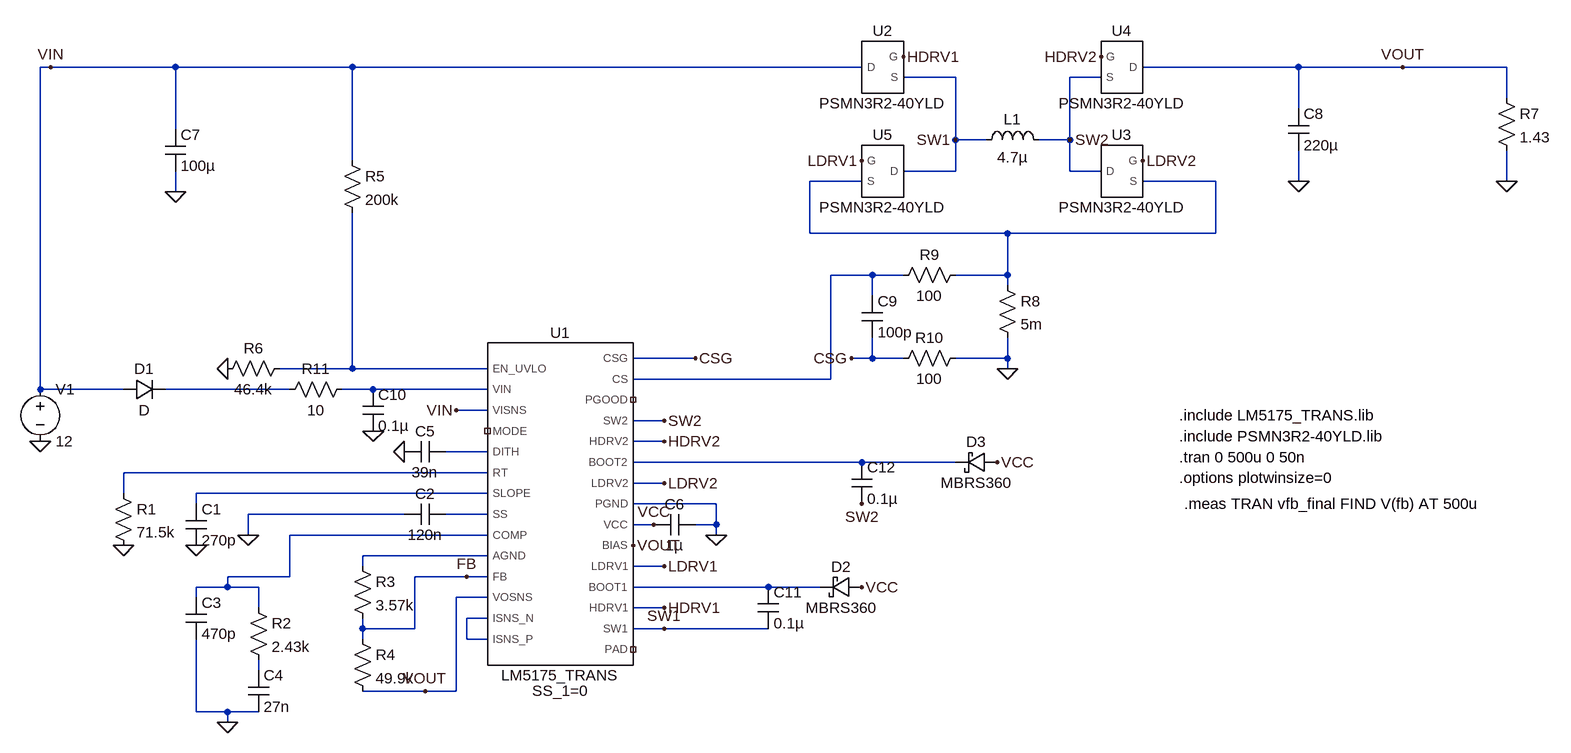
[diagram p0: schematic Buckboost.asc]
Buckboost.asc, the LTspice schematic file:
Version 4.1
SHEET 1 1516 680
WIRE -800 -656 -816 -656
WIRE -608 -656 -800 -656
WIRE -336 -656 -608 -656
WIRE 448 -656 -336 -656
WIRE 1120 -656 880 -656
WIRE 1280 -656 1120 -656
WIRE 1440 -656 1280 -656
WIRE 592 -640 512 -640
WIRE 816 -640 768 -640
WIRE 1440 -608 1440 -656
WIRE 1120 -592 1120 -656
WIRE -608 -560 -608 -656
WIRE 592 -544 592 -640
WIRE 640 -544 592 -544
WIRE 768 -544 768 -640
WIRE 768 -544 720 -544
WIRE -336 -512 -336 -656
WIRE 592 -496 592 -544
WIRE 592 -496 512 -496
WIRE 768 -496 768 -544
WIRE 816 -496 768 -496
WIRE 448 -480 368 -480
WIRE 992 -480 880 -480
WIRE 1120 -480 1120 -528
WIRE 1440 -480 1440 -528
WIRE -608 -464 -608 -496
WIRE 368 -400 368 -480
WIRE 672 -400 368 -400
WIRE 992 -400 992 -480
WIRE 992 -400 672 -400
WIRE 464 -336 400 -336
WIRE 512 -336 464 -336
WIRE 672 -336 672 -400
WIRE 672 -336 592 -336
WIRE 672 -320 672 -336
WIRE 464 -304 464 -336
WIRE 192 -208 96 -208
WIRE 464 -208 464 -240
WIRE 464 -208 432 -208
WIRE 512 -208 464 -208
WIRE 672 -208 672 -240
WIRE 672 -208 592 -208
WIRE -336 -192 -336 -432
WIRE -336 -192 -448 -192
WIRE -128 -192 -336 -192
WIRE 672 -192 672 -208
WIRE 400 -176 400 -336
WIRE 400 -176 96 -176
WIRE -816 -160 -816 -656
WIRE -688 -160 -816 -160
WIRE -432 -160 -624 -160
WIRE -304 -160 -352 -160
WIRE -128 -160 -304 -160
WIRE -128 -128 -176 -128
WIRE 144 -112 96 -112
WIRE 144 -80 96 -80
WIRE -128 -64 -192 -64
WIRE 448 -48 96 -48
WIRE 592 -48 448 -48
WIRE -128 -32 -688 -32
WIRE 144 -16 96 -16
WIRE -688 0 -688 -32
WIRE -128 0 -576 0
WIRE -576 16 -576 0
WIRE 224 16 96 16
WIRE -256 32 -496 32
WIRE -128 32 -192 32
WIRE 128 48 96 48
WIRE 224 48 224 16
WIRE 224 48 192 48
WIRE -496 64 -496 32
WIRE -128 64 -432 64
WIRE 224 64 224 48
WIRE -128 96 -320 96
WIRE -320 112 -320 96
WIRE 144 112 96 112
WIRE -432 128 -432 64
WIRE -432 128 -528 128
WIRE -160 128 -240 128
WIRE -128 128 -160 128
WIRE -528 144 -528 128
WIRE -528 144 -576 144
WIRE -480 144 -528 144
WIRE 304 144 96 144
WIRE 384 144 304 144
WIRE -576 160 -576 144
WIRE -128 160 -176 160
WIRE -480 176 -480 144
WIRE 144 176 96 176
WIRE -128 192 -160 192
WIRE -320 208 -320 192
WIRE -240 208 -240 128
WIRE -240 208 -320 208
WIRE 144 208 96 208
WIRE 304 208 144 208
WIRE -320 224 -320 208
WIRE -160 224 -160 192
WIRE -128 224 -160 224
WIRE -480 272 -480 256
WIRE -224 304 -320 304
WIRE -176 304 -176 160
WIRE -176 304 -224 304
WIRE -576 336 -576 224
WIRE -528 336 -576 336
WIRE -480 336 -528 336
WIRE -528 352 -528 336
FLAG -688 80 0
FLAG -576 80 0
FLAG -496 64 0
FLAG -528 352 0
FLAG -256 -64 0
FLAG 224 64 0
FLAG -816 -80 0
FLAG -528 -192 0
FLAG 128 48 VCC
FLAG 144 208 SW1
FLAG 592 -544 SW1
FLAG 144 -112 SW2
FLAG 768 -544 SW2
FLAG 144 112 LDRV1
FLAG 448 -512 LDRV1
FLAG 144 -16 LDRV2
FLAG 880 -512 LDRV2
FLAG 144 176 HDRV1
FLAG 512 -672 HDRV1
FLAG 816 -672 HDRV2
FLAG 144 -80 HDRV2
FLAG -608 -464 0
FLAG 1120 -480 0
FLAG 1440 -480 0
FLAG 192 -208 CSG
FLAG 432 -208 CSG
FLAG 672 -192 0
FLAG 1280 -656 VOUT
FLAG -224 304 VOUT
FLAG -304 -96 0
FLAG 448 144 VCC
FLAG 448 16 SW2
FLAG 656 -48 VCC
FLAG -800 -656 VIN
FLAG -176 -128 VIN
FLAG 96 80 VOUT
FLAG -160 128 FB
SYMBOL LM5175_TRANS -16 16 R0
SYMATTR InstName U1
SYMBOL res -704 -16 R0
SYMATTR InstName R1
SYMATTR Value 71.5k
SYMBOL cap -592 16 R0
SYMATTR InstName C1
SYMATTR Value 270p
SYMBOL cap -192 16 R90
WINDOW 0 0 32 VBottom 2
WINDOW 3 32 32 VTop 2
SYMATTR InstName C2
SYMATTR Value 120n
SYMBOL res -496 160 R0
SYMATTR InstName R2
SYMATTR Value 2.43k
SYMBOL cap -592 160 R0
SYMATTR InstName C3
SYMATTR Value 470p
SYMBOL cap -496 272 R0
SYMATTR InstName C4
SYMATTR Value 27n
SYMBOL cap -192 -80 R90
WINDOW 0 0 32 VBottom 2
WINDOW 3 32 32 VTop 2
SYMATTR InstName C5
SYMATTR Value 39n
SYMBOL res -336 96 R0
SYMATTR InstName R3
SYMATTR Value 3.57k
SYMBOL res -336 208 R0
SYMATTR InstName R4
SYMATTR Value 49.9k
SYMBOL cap 192 32 R90
WINDOW 0 0 32 VBottom 2
WINDOW 3 32 32 VTop 2
SYMATTR InstName C6
SYMATTR Value 1µ
SYMBOL voltage -816 -176 R0
WINDOW 123 0 0 Left 0
WINDOW 39 0 0 Left 0
SYMATTR InstName V1
SYMATTR Value 12
SYMBOL res -352 -528 R0
SYMATTR InstName R5
SYMATTR Value 200k
SYMBOL res -432 -208 R90
WINDOW 0 0 56 VBottom 2
WINDOW 3 32 56 VTop 2
SYMATTR InstName R6
SYMATTR Value 46.4k
SYMBOL PSMN3R2-40YLD 480 -656 R0
SYMATTR InstName U2
SYMBOL PSMN3R2-40YLD 848 -496 R0
SYMATTR InstName U3
SYMBOL PSMN3R2-40YLD 848 -656 M0
SYMATTR InstName U4
SYMBOL PSMN3R2-40YLD 480 -496 M0
SYMATTR InstName U5
SYMBOL ind 624 -528 R270
WINDOW 0 32 56 VTop 2
WINDOW 3 5 56 VBottom 2
SYMATTR InstName L1
SYMATTR Value 4.7µ
SYMATTR SpiceLine Ipk=35 Rser=3m
SYMBOL cap -624 -560 R0
SYMATTR InstName C7
SYMATTR Value 100µ
SYMBOL res 1424 -624 R0
SYMATTR InstName R7
SYMATTR Value 1.43
SYMBOL cap 1104 -592 R0
SYMATTR InstName C8
SYMATTR Value 220µ
SYMBOL res 656 -336 R0
SYMATTR InstName R8
SYMATTR Value 5m
SYMBOL res 608 -352 R90
WINDOW 0 0 56 VBottom 2
WINDOW 3 32 56 VTop 2
SYMATTR InstName R9
SYMATTR Value 100
SYMBOL res 608 -224 R90
WINDOW 0 0 56 VBottom 2
WINDOW 3 32 56 VTop 2
SYMATTR InstName R10
SYMATTR Value 100
SYMBOL cap 448 -304 R0
SYMATTR InstName C9
SYMATTR Value 100p
SYMBOL diode -688 -144 R270
WINDOW 0 32 32 VTop 2
WINDOW 3 0 32 VBottom 2
SYMATTR InstName D1
SYMBOL res -336 -176 R90
WINDOW 0 0 56 VBottom 2
WINDOW 3 32 56 VTop 2
SYMATTR InstName R11
SYMATTR Value 10
SYMBOL cap -320 -160 R0
SYMATTR InstName C10
SYMATTR Value 0.1µ
SYMBOL schottky 448 128 R90
WINDOW 0 0 32 VBottom 2
WINDOW 3 32 32 VTop 2
SYMATTR InstName D2
SYMATTR Value MBRS360
SYMATTR Description Diode
SYMATTR Type diode
SYMBOL cap 288 144 R0
SYMATTR InstName C11
SYMATTR Value 0.1µ
SYMBOL schottky 656 -64 R90
WINDOW 0 0 32 VBottom 2
WINDOW 3 32 32 VTop 2
SYMATTR InstName D3
SYMATTR Value MBRS360
SYMATTR Description Diode
SYMATTR Type diode
SYMBOL cap 432 -48 R0
SYMATTR InstName C12
SYMATTR Value 0.1µ
TEXT 936 -120 Left 2 !.include LM5175_TRANS.lib
TEXT 936 -88 Left 2 !.include PSMN3R2-40YLD.lib
TEXT 936 -56 Left 2 !.tran 0 500u 0 50n
TEXT 936 -24 Left 2 !.options plotwinsize=0
TEXT 944 16 Left 2 !.meas TRAN vfb_final FIND V(fb) AT 500u

The netlist it stands for:
* Buckboost.asc
X§U1 N003 N005 VIN NC_01 N006 N008 N009 N010 N011 N012 FB VOUT N014 N014 CSG N002 NC_02 SW2 HDRV2 N007 LDRV2 0 VCC VOUT LDRV1 N013 HDRV1 SW1 NC_03 LM5175_TRANS SS_1=0  ; pins EN_UVLO VIN VISNS MODE DITH RT SLOPE SS COMP AGND FB VOSNS ISNS_N ISNS_P CSG CS PGOOD SW2 HDRV2 BOOT2 LDRV2 PGND VCC BIAS LDRV1 BOOT1 HDRV1 SW1 PAD
R1 N008 0 71.5k
C1 N009 0 270p
C2 N010 0 120n
R2 N011 N015 2.43k
C3 N011 0 470p
C4 N015 0 27n
C5 N006 0 39n
R3 N012 FB 3.57k
R4 FB VOUT 49.9k
C6 0 VCC 1µ
V1 VIN 0 12
R5 VIN N003 200k
R6 N003 0 46.4k
X§U2 VIN HDRV1 SW1 PSMN3R2-40YLD  ; pins D G S
X§U3 SW2 LDRV2 N001 PSMN3R2-40YLD  ; pins D G S
X§U4 VOUT HDRV2 SW2 PSMN3R2-40YLD  ; pins D G S
X§U5 SW1 LDRV1 N001 PSMN3R2-40YLD  ; pins D G S
L1 SW1 SW2 4.7µ Ipk=35 Rser=3m
C7 VIN 0 100µ
R7 VOUT 0 1.43
C8 VOUT 0 220µ
R8 N001 0 5m
R9 N001 N002 100
R10 0 CSG 100
C9 N002 CSG 100p
D1 VIN N004 D
R11 N005 N004 10
C10 N005 0 0.1µ
D2 VCC N013 MBRS360
C11 N013 SW1 0.1µ
D3 VCC N007 MBRS360
C12 N007 SW2 0.1µ
.model D D
.lib standard.dio
.include LM5175_TRANS.lib
.include PSMN3R2-40YLD.lib
.tran 0 500u 0 50n
.options plotwinsize=0
.meas TRAN vfb_final FIND V(fb) AT 500u
.lib LM5175_TRANS.lib
.lib PSMN3R2-40YLD.lib
.backanno
.end